# EAGLE board Comim_OBC-v.3.0 (EAGLE 9.4.2)
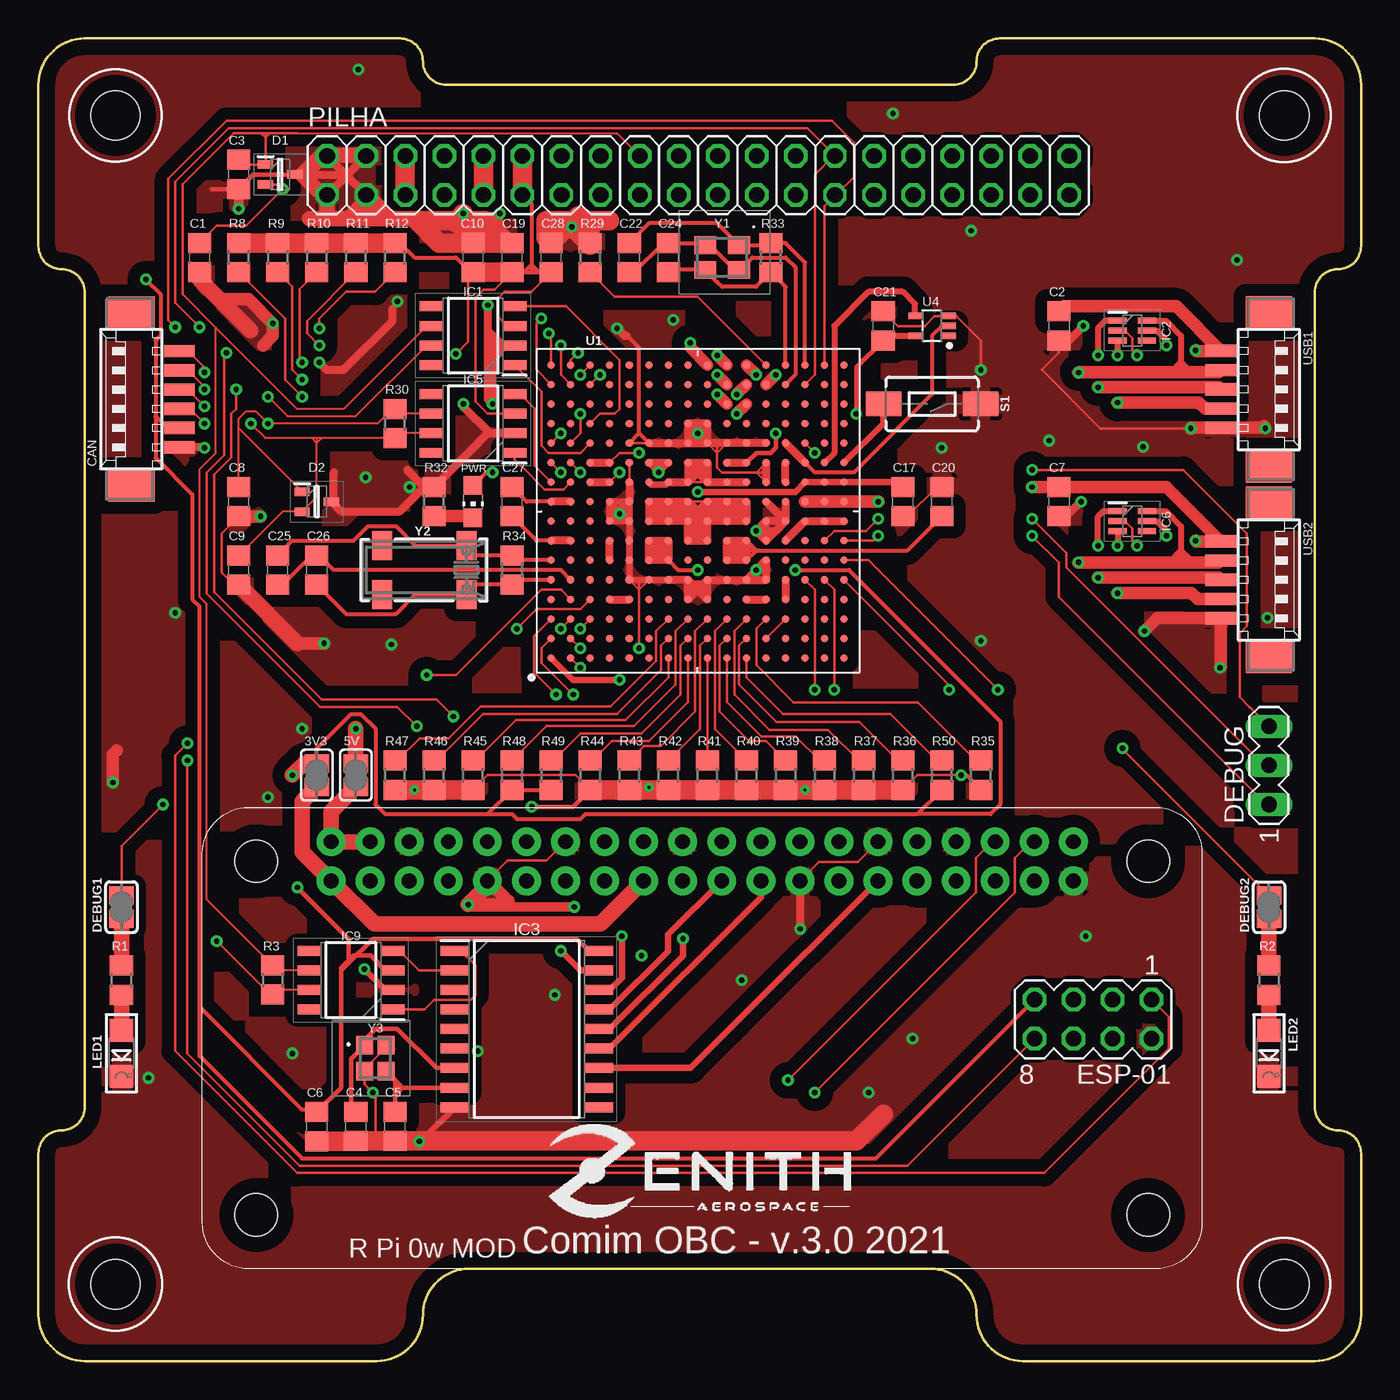
[diagram p5: board, top side]
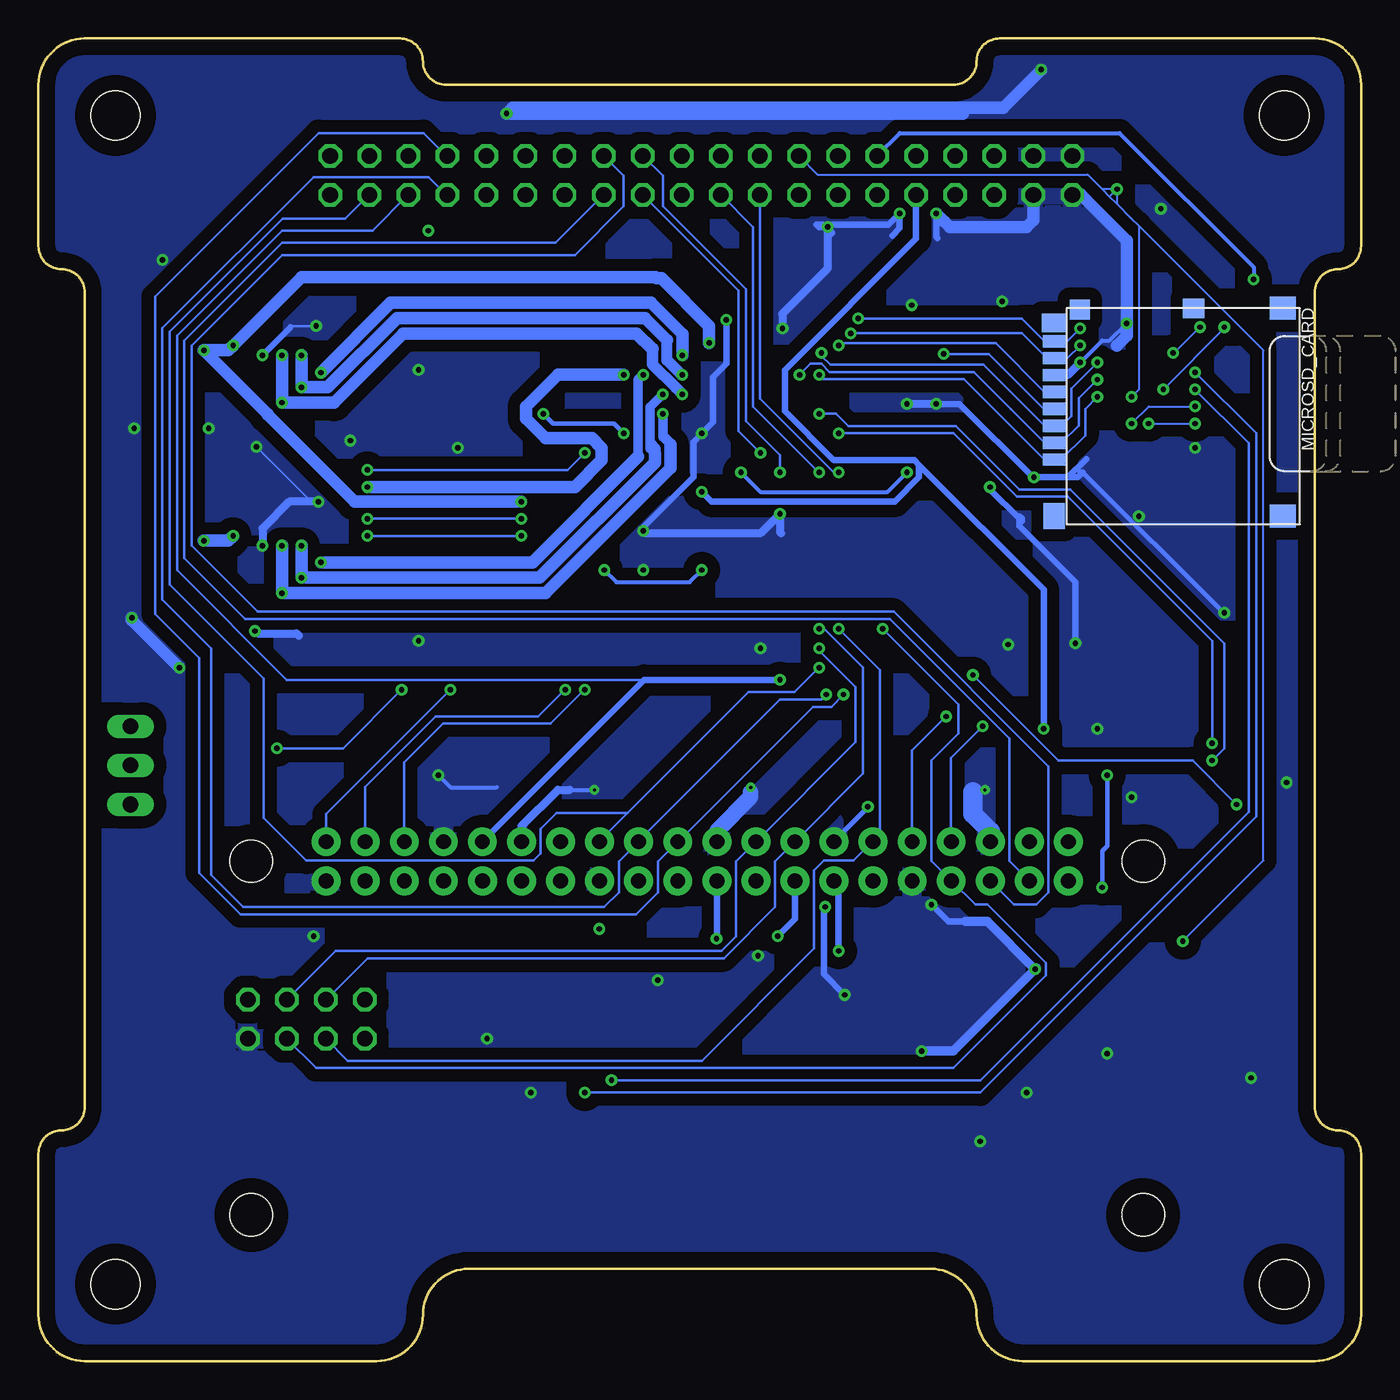
[diagram p6: board, bottom side, seen from below]

Size 86 x 86 mm. Coordinates in mm from the lower left corner, seen from the top.
Outline: 0,83 0,72.5 arc90 1.5,71 arc-90 3,69.5 3,16.5 arc-90 1.5,15 arc90 0,13.5 0,3 arc90 3,0 22,0 arc90 25,3 arc-90 28,6 58,6 arc-90 61,3 arc90 64,0 83,0 arc90 86,3 86,13.5 arc90 84.5,15 arc-90 83,16.5 83,69.5 arc-90 84.5,71 arc90 86,72.5 86,83 arc90 83,86 62.5,86 arc90 61,84.5 arc-90 59.5,83 26.5,83 arc-90 25,84.5 arc90 23.5,86 3,86 arc90 0,83
Copper layers (1*16): Top 0.035mm / dielectric 1.5mm / Bottom 0.035mm
Design rules "default *": minimum track width 6mil, minimum drill 0.35mm, track to track 6mil, track to pad 6mil, pad to pad 6mil, via to via 6mil, smd to smd 6mil, copper to edge 40mil, drill to drill 6mil, minimum pad ring 10mil, minimum via ring 8mil, stop-mask expansion 4mil, vias tented up to drill 30mil, thermal gap 10mil
Holes 3.2 mm at 5,5 81,5 81,81 5,81

## Footprints (pad centres in the part's own frame; a part is rotated, then mirrored left to right if it is on the bottom)
SJ = smd 1.168 x 1.6: 1 -0.762,0; 2 0.762,0
C0805 = smd 1.3 x 1.5: 1 -0.95,0; 2 0.95,0
53261-06 = smd 0.8 x 2: 1 3.125,-2.5; 2 1.875,-2.5; 3 0.625,-2.5; 4 -0.625,-2.5; 5 -1.875,-2.5; 6 -3.125,-2.5 | smd 2.1 x 3: S1 5.625,0.625; S2 -5.625,0.625
SOT65P210X110-3N = smd 1 x 0.55: 1 -0.95,0.65; 2 -0.95,-0.65; 3 0.95,0
MA03-1 = drill 1.016 long: 1 -2.54,0; 2 0,0; 3 2.54,0
SOLDERJUMPER_REFLOW_NOPASTE = smd 1.168 x 1.6: 1 -0.762,0; 2 0.762,0
MA04-2 = drill 1.016 octagon: 1 -3.81,-1.27; 2 -3.81,1.27; 3 -1.27,-1.27; 4 -1.27,1.27; 5 1.27,-1.27; 6 1.27,1.27; 7 3.81,-1.27; 8 3.81,1.27
SOIC127P600X175-8N = smd 1.528 x 0.65: 1 -2.711,1.905; 2 -2.711,0.635; 3 -2.711,-0.635; 4 -2.711,-1.905; 5 2.711,-1.905; 6 2.711,-0.635; 7 2.711,0.635; 8 2.711,1.905
SOT65P210X110-6N = smd 1.2 x 0.4: 1 -0.95,0.65; 2 -0.95,0; 3 -0.95,-0.65; 4 0.95,-0.65; 5 0.95,0; 6 0.95,0.65
SOIC127P1030X265-18N = smd 1.85 x 0.65: 1 -4.675,5.08; 2 -4.675,3.81; 3 -4.675,2.54; 4 -4.675,1.27; 5 -4.675,0; 6 -4.675,-1.27; 7 -4.675,-2.54; 8 -4.675,-3.81; 9 -4.675,-5.08; 10 4.675,-5.08; 11 4.675,-3.81; 12 4.675,-2.54; 13 4.675,-1.27; 14 4.675,0; 15 4.675,1.27; 16 4.675,2.54; 17 4.675,3.81; 18 4.675,5.08
CHIPLED_1206 = smd 1.5 x 1.5: A 0,-1.496; C 0,1.496
MOLEX-502774-0891-MICROSD = smd 0.8 x 1.5: 1 -3.3,8.2; 2 -2.2,8.2; 3 -1.1,8.2; 4 0,8.2; 5 1.1,8.2; 6 2.2,8.2; 7 3.3,8.2; 8 4.4,8.2 | smd 1.29 x 1.3: 9 6.455,6.55 | smd 1.29 x 1.4: 10 6.54,-0.85 | smd 1.5 x 1.7: 11 6.54,-6.65; 12 -6.96,-6.65 | smd 1.7 x 1.4: 14 -6.96,8.2 | smd 1.2 x 1.6: 15 5.6,8.2
2X20 = drill 1.016 octagon: 1 -24.13,-1.27; 2 -24.13,1.27; 3 -21.59,-1.27; 4 -21.59,1.27; 5 -19.05,-1.27; 6 -19.05,1.27; 7 -16.51,-1.27; 8 -16.51,1.27; 9 -13.97,-1.27; 10 -13.97,1.27; 11 -11.43,-1.27; 12 -11.43,1.27; 13 -8.89,-1.27; 14 -8.89,1.27; 15 -6.35,-1.27; 16 -6.35,1.27; 17 -3.81,-1.27; 18 -3.81,1.27; 19 -1.27,-1.27; 20 -1.27,1.27; 21 1.27,-1.27; 22 1.27,1.27; 23 3.81,-1.27; 24 3.81,1.27; 25 6.35,-1.27; 26 6.35,1.27; 27 8.89,-1.27; 28 8.89,1.27; 29 11.43,-1.27; 30 11.43,1.27; 31 13.97,-1.27; 32 13.97,1.27; 33 16.51,-1.27; 34 16.51,1.27; 35 19.05,-1.27; 36 19.05,1.27; 37 21.59,-1.27; 38 21.59,1.27; 39 24.13,-1.27; 40 24.13,1.27
CHIP-LED0805 = smd 1.2 x 1.2: A 0,-1.05; C 0,1.05
R0805 = smd 1.3 x 1.5: 1 -0.95,0; 2 0.95,0
TACTILE_SWITCH_SMD_6.0X3.5MM = smd 2.3 x 1.6: 1 -3.15,0; 2 3.15,0
OSD335X-BGA-256 = smd 0.5 x 0.5: A1 -9.525,-9.525; A2 -9.525,-8.255; A3 -9.525,-6.985; A4 -9.525,-5.715; A5 -9.525,-4.445; A6 -9.525,-3.175; A7 -9.525,-1.905; A8 -9.525,-0.635; A9 -9.525,0.635; A10 -9.525,1.905; A11 -9.525,3.175; A12 -9.525,4.445; A13 -9.525,5.715; A14 -9.525,6.985; A15 -9.525,8.255; A16 -9.525,9.525; B1 -8.255,-9.525; B2 -8.255,-8.255; B3 -8.255,-6.985; B4 -8.255,-5.715; B5 -8.255,-4.445; B6 -8.255,-3.175; B7 -8.255,-1.905; B8 -8.255,-0.635; B9 -8.255,0.635; B10 -8.255,1.905; B11 -8.255,3.175; B12 -8.255,4.445; B13 -8.255,5.715; B14 -8.255,6.985; B15 -8.255,8.255; B16 -8.255,9.525; C1 -6.985,-9.525; C2 -6.985,-8.255; C3 -6.985,-6.985; C4 -6.985,-5.715; C5 -6.985,-4.445; C6 -6.985,-3.175; C7 -6.985,-1.905; C8 -6.985,-0.635; C9 -6.985,0.635; C10 -6.985,1.905; C11 -6.985,3.175; C12 -6.985,4.445; C13 -6.985,5.715; C14 -6.985,6.985; C15 -6.985,8.255; C16 -6.985,9.525; D1 -5.715,-9.525; D2 -5.715,-8.255; D3 -5.715,-6.985; D4 -5.715,-5.715; D5 -5.715,-4.445; D6 -5.715,-3.175; D7 -5.715,-1.905; D8 -5.715,-0.635; D9 -5.715,0.635; D10 -5.715,1.905; D11 -5.715,3.175; D12 -5.715,4.445; D13 -5.715,5.715; D14 -5.715,6.985; D15 -5.715,8.255; D16 -5.715,9.525; E1 -4.445,-9.525; E2 -4.445,-8.255; E3 -4.445,-6.985; E4 -4.445,-5.715; E5 -4.445,-4.445; E6 -4.445,-3.175; E7 -4.445,-1.905; E8 -4.445,-0.635; E9 -4.445,0.635; E10 -4.445,1.905; E11 -4.445,3.175; E12 -4.445,4.445; E13 -4.445,5.715; E14 -4.445,6.985; E15 -4.445,8.255; E16 -4.445,9.525; F1 -3.175,-9.525; F2 -3.175,-8.255; F3 -3.175,-6.985; F4 -3.175,-5.715; F5 -3.175,-4.445; F6 -3.175,-3.175; F7 -3.175,-1.905; F8 -3.175,-0.635; F9 -3.175,0.635; F10 -3.175,1.905; F11 -3.175,3.175; F12 -3.175,4.445; F13 -3.175,5.715; F14 -3.175,6.985; F15 -3.175,8.255; F16 -3.175,9.525; G1 -1.905,-9.525; G2 -1.905,-8.255; G3 -1.905,-6.985; G4 -1.905,-5.715; G5 -1.905,-4.445; G6 -1.905,-3.175; G7 -1.905,-1.905; G8 -1.905,-0.635; G9 -1.905,0.635; G10 -1.905,1.905; G11 -1.905,3.175; G12 -1.905,4.445; G13 -1.905,5.715; G14 -1.905,6.985; G15 -1.905,8.255; G16 -1.905,9.525; H1 -0.635,-9.525; H2 -0.635,-8.255; H3 -0.635,-6.985; H4 -0.635,-5.715; H5 -0.635,-4.445; H6 -0.635,-3.175; H7 -0.635,-1.905; H8 -0.635,-0.635; H9 -0.635,0.635; H10 -0.635,1.905; H11 -0.635,3.175; H12 -0.635,4.445; H13 -0.635,5.715; H14 -0.635,6.985; H15 -0.635,8.255; H16 -0.635,9.525; J1 0.635,-9.525; J2 0.635,-8.255; J3 0.635,-6.985; J4 0.635,-5.715; J5 0.635,-4.445; J6 0.635,-3.175; J7 0.635,-1.905; J8 0.635,-0.635; J9 0.635,0.635; J10 0.635,1.905; J11 0.635,3.175; J12 0.635,4.445; J13 0.635,5.715; J14 0.635,6.985; J15 0.635,8.255; J16 0.635,9.525; K1 1.905,-9.525; K2 1.905,-8.255; K3 1.905,-6.985; K4 1.905,-5.715; K5 1.905,-4.445; K6 1.905,-3.175; K7 1.905,-1.905; K8 1.905,-0.635; K9 1.905,0.635; K10 1.905,1.905; K11 1.905,3.175; K12 1.905,4.445; K13 1.905,5.715; K14 1.905,6.985; K15 1.905,8.255; K16 1.905,9.525; L1 3.175,-9.525; L2 3.175,-8.255; L3 3.175,-6.985; L4 3.175,-5.715; L5 3.175,-4.445; L6 3.175,-3.175; L7 3.175,-1.905; L8 3.175,-0.635; L9 3.175,0.635; L10 3.175,1.905; L11 3.175,3.175; L12 3.175,4.445; L13 3.175,5.715; L14 3.175,6.985; L15 3.175,8.255; L16 3.175,9.525; M1 4.445,-9.525; M2 4.445,-8.255; M3 4.445,-6.985; M4 4.445,-5.715; M5 4.445,-4.445; M6 4.445,-3.175; M7 4.445,-1.905; M8 4.445,-0.635; M9 4.445,0.635; M10 4.445,1.905; M11 4.445,3.175; M12 4.445,4.445; M13 4.445,5.715; M14 4.445,6.985; M15 4.445,8.255; M16 4.445,9.525; N1 5.715,-9.525; N2 5.715,-8.255; N3 5.715,-6.985; N4 5.715,-5.715; N5 5.715,-4.445; N6 5.715,-3.175; N7 5.715,-1.905; N8 5.715,-0.635; N9 5.715,0.635; N10 5.715,1.905; N11 5.715,3.175; N12 5.715,4.445; N13 5.715,5.715; N14 5.715,6.985; N15 5.715,8.255; N16 5.715,9.525; P1 6.985,-9.525; P2 6.985,-8.255; P3 6.985,-6.985; P4 6.985,-5.715; P5 6.985,-4.445; P6 6.985,-3.175; P7 6.985,-1.905; P8 6.985,-0.635; P9 6.985,0.635; P10 6.985,1.905; P11 6.985,3.175; P12 6.985,4.445; P13 6.985,5.715; P14 6.985,6.985; P15 6.985,8.255; P16 6.985,9.525; R1 8.255,-9.525; R2 8.255,-8.255; R3 8.255,-6.985; R4 8.255,-5.715; R5 8.255,-4.445; R6 8.255,-3.175; R7 8.255,-1.905; R8 8.255,-0.635; R9 8.255,0.635; R10 8.255,1.905; R11 8.255,3.175; R12 8.255,4.445; R13 8.255,5.715; R14 8.255,6.985; R15 8.255,8.255; R16 8.255,9.525; T1 9.525,-9.525; T2 9.525,-8.255; T3 9.525,-6.985; T4 9.525,-5.715; T5 9.525,-4.445; T6 9.525,-3.175; T7 9.525,-1.905; T8 9.525,-0.635; T9 9.525,0.635; T10 9.525,1.905; T11 9.525,3.175; T12 9.525,4.445; T13 9.525,5.715; T14 9.525,6.985; T15 9.525,8.255; T16 9.525,9.525
RASPBERRY-PI-ZERO = drill 0.97 pad 1.88: 1 -23.97,23.23; 2 -23.97,25.77; 3 -21.43,23.23; 4 -21.43,25.77; 5 -18.89,23.23; 6 -18.89,25.77; 7 -16.35,23.23; 8 -16.35,25.77; 9 -13.81,23.23; 10 -13.81,25.77; 11 -11.27,23.23; 12 -11.27,25.77; 13 -8.73,23.23; 14 -8.73,25.77; 15 -6.19,23.23; 16 -6.19,25.77; 17 -3.65,23.23; 18 -3.65,25.77; 19 -1.11,23.23; 20 -1.11,25.77; 21 1.43,23.23; 22 1.43,25.77; 23 3.97,23.23; 24 3.97,25.77; 25 6.51,23.23; 26 6.51,25.77; 27 9.05,23.23; 28 9.05,25.77; 29 11.59,23.23; 30 11.59,25.77; 31 14.13,23.23; 32 14.14,25.77; 33 16.67,23.23; 34 16.67,25.77; 35 19.21,23.23; 36 19.21,25.77; 37 21.75,23.23; 38 21.75,25.77; 39 24.29,23.23; 40 24.29,25.77 | hole 2.75: -28.84,24.5; 29.16,24.5; -28.84,1.5; 29.16,1.5
SC70(TI-DCK) = smd 0.4 x 0.9: 1 0.65,1.1; 2 0,1.1; 3 -0.65,1.1; 4 -0.65,-1.1; 5 0.65,-1.1
53261-05 = smd 0.8 x 2: 1 2.5,-2.5; 2 1.25,-2.5; 3 0,-2.5; 4 -1.25,-2.5; 5 -2.5,-2.5 | smd 2.1 x 3: S1 5,0.625; S2 -5,0.625
TSX3225240000MF15VC0 = smd 1.4 x 1.15: 1 -1.1,-0.8; 2 1.1,-0.8; 3 1.1,0.8; 4 -1.1,0.8
CRYSTAL_8X3.8 = smd 1.3 x 1.9: P$1 -2.75,-1.6; P$2 2.75,-1.6; P$3 2.75,1.6; P$4 -2.75,1.6
FA20H160000MF12ZAC3 = smd 1.2 x 1.1: 1 -0.85,-0.7; 2 0.85,-0.7; 3 0.85,0.7; 4 -0.85,0.7

## Placement (x,y rotation side)
3V3  [SJ]  18.1,38.1 270 top
5V  [SJ]  20.64,38.1 90 top
C1  33p  [C0805]  10.48,71.75 270 top
C2  100n  [C0805]  66.36,67.31 270 top
C3  33p  [C0805]  13.02,77.15 270 top
C4  18p  [C0805]  20.64,15.25 270 top
C5  18p  [C0805]  23.18,15.25 270 top
C6  100nF  [C0805]  18.1,15.24 270 top
C7  100n  [C0805]  66.36,55.88 270 top
C8  33p  [C0805]  13.02,55.88 270 top
C9  33p  [C0805]  13.02,51.44 270 top
C10  100n  [C0805]  28.26,71.75 90 top
C17  22u  [C0805]  56.2,55.88 270 top
C19  1n  [C0805]  30.8,71.75 90 top
C20  22u  [C0805]  58.74,55.88 90 top
C21  100n  [C0805]  54.93,67.31 90 top
C22  18p  [C0805]  38.42,71.75 270 top
C24  18p  [C0805]  40.96,71.75 90 top
C25  18p  [C0805]  15.56,51.44 270 top
C26  18p  [C0805]  18.1,51.44 90 top
C27  100n  [C0805]  30.8,55.88 90 top
C28  1n  [C0805]  33.34,71.75 90 top
CAN  53261-06  [53261-06]  6.67,62.55 90 top
D1  PESD2CANFD27L-UX  [SOT65P210X110-3N]  15.72,77.15 0 top
D2  PESD2CANFD27L-UX  [SOT65P210X110-3N]  18.1,55.88 0 top
DEBUG  [MA03-1]  80.01,38.73 90 top
DEBUG1  [SOLDERJUMPER_REFLOW_NOPASTE]  5.4,29.51 270 top
DEBUG2  [SOLDERJUMPER_REFLOW_NOPASTE]  80.01,29.51 270 top
ESP-01  [MA04-2]  68.58,22.23 180 top
IC1  TCAN330DR  [SOIC127P600X175-8N]  28.26,66.67 180 top
IC2  TPD4S009DCKRG4  [SOT65P210X110-6N]  71.12,66.99 0 top
IC3  MCP2510T-I_SO  [SOIC127P1030X265-18N]  31.75,21.59 0 top
IC5  TCAN330DR  [SOIC127P600X175-8N]  28.26,60.96 180 top
IC6  TPD4S009DCKRG4  [SOT65P210X110-6N]  71.12,54.61 0 top
IC9  TCAN330DR  [SOIC127P600X175-8N]  20.32,24.78 180 top
LED1  [CHIPLED_1206]  5.4,20.02 180 top
LED2  [CHIPLED_1206]  80.01,20.02 180 top
MICROSD_CARD  MOLEX-502774-0891-MICROSD  [MOLEX-502774-0891-MICROSD]  11.75,61.91 90 bottom
PILHA  [2X20]  42.9,77.1 0 top
PWR  [CHIP-LED0805]  28.26,55.88 180 top
R1  100M  [R0805]  5.4,24.77 90 top
R2  100M  [R0805]  80.01,24.77 90 top
R3  120  [R0805]  15.24,24.78 90 top
R8  4,7k  [R0805]  13.02,71.75 90 top
R9  4,7k  [R0805]  15.56,71.75 90 top
R10  4,7k  [R0805]  18.1,71.75 90 top
R11  4,7k  [R0805]  20.64,71.75 90 top
R12  4,7k  [R0805]  23.18,71.75 90 top
R29  10k  [R0805]  35.88,71.75 270 top
R30  120  [R0805]  23.18,60.96 90 top
R32  1k  [R0805]  25.72,55.88 270 top
R33  1M  [R0805]  47.62,71.75 90 top
R34  1M  [R0805]  30.8,51.44 90 top
R35  100k  [R0805]  61.28,38.1 90 top
R36  100k  [R0805]  56.2,38.1 90 top
R37  100k  [R0805]  53.66,38.1 90 top
R38  100k  [R0805]  51.12,38.1 90 top
R39  100k  [R0805]  48.58,38.1 90 top
R40  100k  [R0805]  46.04,38.1 90 top
R41  100k  [R0805]  43.5,38.1 90 top
R42  100k  [R0805]  40.96,38.1 90 top
R43  100k  [R0805]  38.42,38.1 90 top
R44  100k  [R0805]  35.88,38.1 90 top
R45  100k  [R0805]  28.26,38.1 90 top
R46  100k  [R0805]  25.72,38.1 90 top
R47  100k  [R0805]  23.18,38.1 90 top
R48  100k  [R0805]  30.8,38.1 270 top
R49  100k  [R0805]  33.34,38.1 270 top
R50  100k  [R0805]  58.74,38.1 270 top
S1  MOMENTARY-SWITCH-SPST-SMD-6.0X3.5MM  [TACTILE_SWITCH_SMD_6.0X3.5MM]  58.1,62.23 180 top
U1  OSD3358-512M-BSM  [OSD335X-BGA-256]  42.86,55.24 0 top
U2  RASPBERRY-PI+PIZERO  [RASPBERRY-PI-ZERO]  43,8 0 top
U4  SN74LVC1G07DCK  [SC70(TI-DCK)]  58.1,67.31 270 top
USB1  53261-05  [53261-05]  79.38,63.18 270 top
USB2  53261-05  [53261-05]  79.38,50.8 270 top
Y1  TSX-3225_24.0000MF15V-C0  [TSX3225240000MF15VC0]  44.45,71.75 180 top
Y2  32kHz  [CRYSTAL_8X3.8]  25.08,51.44 180 top
Y3  FA-20H_16.0000MF10Z-AJ0  [FA20H160000MF12ZAC3]  21.91,19.7 270 top

## Tracks (layer width: path | path; a pad name or v marks a point on that pad's centre or on a via)
3V3  (via drill 0.35)
  Top 0.152: C28.1 32.06,69.53 30.32,69.53 29.84,69.06 29.84,67.94 30.48,67.31 IC1.3 | IC5.3 29.21,61.59 28.42,62.39 28.42,69.14 28.93,69.65 29.64,69.65 C19.1 31.75,70.81 | v27.15,65.48 27.94,66.28 27.94,70.49 C10.1
  Top 0.254: R49.2 R48.2 29.21,35.56 | 32.07,70.81 31.75,70.81 31.59,70.81 32.06,71.28 32.07,71.28 | 32.07,70.81 32.54,70.81 | 32.54,70.81 C28.1 | PILHA.11 32.07,75.23 32.07,71.28 | 32.07,71.28 32.07,70.81 | 32.54,70.81 32.07,71.28 | 15.24,72.7 15.4,72.7 R9.2 R10.2 | 20.8,72.7 R11.2 | R12.2 23.5,72.7 24.45,71.75 27.15,71.75 27.98,70.92 30.36,70.92 | CAN.5 8.38,60.67 7.62,61.44 | 7.62,61.44 7.62,66.36 7.94,66.67 7.94,69.37 v6.99,70.33 | 7.62,61.44 7.62,58.74 10,56.36 10,49.53 10.48,49.05 10.48,23.02 | 10.48,23.02 17.14,16.35 17.46,16.35 17.94,16.35 | 3V3.1 18.1,39.85 20.32,42.07 20.95,42.07 21.91,41.12 21.91,36.2 22.54,35.56 29.21,35.56 | 29.21,35.56 30.8,35.56 31.11,35.24 35.24,35.24 35.56,35.56 57.15,35.56 | 57.15,35.56 R50.2 | U1.G6 41.59,51.44 v42.86,51.44 | 57.15,35.56 61.91,35.56 62.55,36.2 62.55,41.59 52.7,51.44 v49.21,51.44 | ESP-01.7 54.45,13.18 17.14,13.18 10.48,19.84 10.48,23.02
  Top 0.305: 19.68,25.4 19.68,17.78 C6.1 | 19.68,25.4 19.68,25.56 20.49,26.36 21.6,26.36 22.55,25.41 IC9.3 | 19.68,25.4 20.16,25.88 | 20.16,25.88 21.75,27.46 35,27.46 35.79,26.67 IC3.18 | 20.16,25.88 20.16,27.46 v16.83,30.8
  Top 0.406: C6.1 17.62,16.19 17.46,16.35 | C19.1 30.48,70.81 30.36,70.92
  Top 0.508: U1.F7 U1.G7 | U1.G7 U1.G6 | U1.G6 U1.F6 | U1.F6 U1.F7 | U1.F7 U1.G6 | U1.G7 U1.F6
  Top 1.016: v16.51,38.1 17.27,38.86 3V3.1
  Top 1.27: PILHA.12 PILHA.11 | R12.2 20.8,72.7 | R11.2 R10.2 15.4,72.7 | R8.2 15.24,72.7 | C10.1 C19.1
  Bottom 0.152: MICROSD_CARD.4 20.64,61.91 24.21,65.48 v27.15,65.48
  Bottom 0.254: v49.21,51.44 48.42,50.64 43.66,50.64 v42.86,51.44 | v6.99,70.33 6.99,71.12 15.72,79.85 29.99,79.85 PILHA.12
  Bottom 0.305: v16.83,30.8 16.83,33.18 16.51,33.5 v16.51,38.1
5V  (via drill 0.35)
  Top 0.406: v42.86,56.52 49.21,56.52 U1.P10 U1.R10 U1.T10 55.88,57.15 C17.1
  Top 1.016: 5V.2 v20.64,41.12
  Top 1.27: PILHA.10 PILHA.9
  Bottom 0.254: 34.29,58.58 34.37,58.66
  Bottom 0.406: v42.86,56.52 42.23,55.88 30.32,55.88 28.73,57.47 28.73,58.26 | 28.73,58.26 29.05,58.58 34.29,58.58 | PILHA.9 28.93,72.97 37.47,64.44 37.47,61.75 34.37,58.66 | v20.64,41.12 20.64,50.16 28.73,58.26
!CHRG  (via drill 0.35)
  Top 0.152: v33.66,43.34 32.23,44.77 32.23,47.15 U1.A3
  Bottom 0.152: PILHA.34 59.48,78.37 60.96,79.85 67.79,79.85 78.42,69.22 78.42,48.58 75.56,45.72 75.56,31.75 72.87,29.05 47.15,29.05 45.72,30.48 45.72,32.48 U2.22 35.66,42.55 34.45,42.55 v33.66,43.34
!CS_CAN  (via drill 0.35)
  Top 0.406: IC3.16 37.15,24.13 37.94,24.92 v37.94,27.62
  Bottom 0.406: v37.94,27.62 36.81,28.75 U2.15
!FAULT  (via drill 0.35)
  Top 0.152: U1.B1 v35.24,45.09
  Bottom 0.152: PILHA.37 64.5,75.83 66.05,74.28 70.14,74.28 77.47,66.95 77.47,50.48 71.36,44.37 71.36,35.32 68.58,32.54 53.82,32.54 53.34,33.02 53.34,34.61 52.31,35.64 47.7,35.64 | v35.24,45.09 36.83,43.5 39.85,43.5 47.7,35.64 | 47.7,35.64 49.51,33.83 U2.26
!INT_CAN
  Top 0.406: U2.29 45.34,21.98 44.91,21.55 42.41,19.05 IC3.12
!RESET_CAN  (via drill 0.35)
  Top 0.406: IC3.17 35.24,25.4 v33.97,26.67
  Bottom 0.406: v33.97,26.67 33.97,30.93 U2.13
ALRT1  (via drill 0.35)
  Top 0.152: U1.A2 32.7,46.35 32.7,45.4 v34.77,43.34
  Bottom 0.152: PILHA.33 59.48,75.83 60.64,76.99 68.1,76.99 77.95,67.15 77.95,49.53 74.76,46.34 74.76,31.61 72.68,29.53 49.21,29.53 48.26,30.48 48.26,32.48 U2.24 46.97,33.83 37.78,43.02 35.08,43.02 v34.77,43.34
BAT+
  Top 1.27: PILHA.6 PILHA.5
CAN0_H  (via drill 0.35)
  Top 0.127: v13.81,60.96 14.76,60.01 17.78,60.01 | CAN.4 9.83,61.92 | IC5.7 23.49,60.33 | R30.1 18.41,60.01 | 18.41,60.01 18.1,60.01 | 18.1,60.01 17.78,60.01 | 18.1,59.69 18.1,56.18 D2.2 15.86,55.23 C9.1 | 18.1,60.01 18.1,59.69 | 18.1,59.69 18.41,60.01 | 18.1,59.69 17.78,60.01
  Top 0.152: v13.81,60.96 | 9.83,61.92 v10.79,60.96 | 23.49,60.33 R30.1
  Bottom 0.127: v13.81,60.96 v10.79,60.96
CAN0_L  (via drill 0.35)
  Top 0.127: 23.02,61.91 22.9,61.79 22.07,60.96 v14.92,60.96 14.13,61.75 13.49,61.75 13.02,61.28 13.02,60.66 | CAN.3 9.69,63.17 | IC5.6 23.49,61.59 | D2.1 13.02,60.66 | C8.1 13.02,60.66
  Top 0.152: 9.69,63.17 v10.79,62.07 | 23.49,61.59 R30.2
  Top 0.406: R30.2 23.06,61.79 22.9,61.79
  Bottom 0.127: v14.92,60.96 13.81,62.07 v10.79,62.07
CAN0RX
  Top 0.152: U1.A10 32.26,58.23 32.26,61.92 31.31,62.87 IC5.4
CAN0TX
  Top 0.152: U1.B10 34.13,56.67 32.92,56.67 31.38,58.21 31.33,58.26 30.97,58.63 IC5.1
CAN1RX
  Top 0.152: U1.C13 36.51,61.59 37.47,61.59 37.78,61.91 37.78,65.09 34.29,68.58 IC1.4
CAN1TX
  Top 0.152: U1.C12 35.24,59.05 33.18,59.05 32.7,59.53 32.7,63.04 IC1.1
CAN_H  (via drill 0.35)
  Top 0.127: 15.07,23.83 v11.59,27.3 | v14.92,62.71 16.19,61.44 20.64,61.44 25.24,66.04 | IC9.7 15.55,24.14
  Top 0.152: R3.1 15.07,23.83 | 25.24,66.04 IC1.7 | D1.2 15.57,76.5 v15.88,76.2 13.49,73.82 11.59,73.82 C1.1
  Top 0.584: 15.55,24.14 R3.1
  Bottom 0.127: PILHA.16 35.33,77.15 17.78,77.15 16.83,76.2 | 14.45,73.82 6.35,65.72 6.35,32.54 v11.59,27.3 | 15.88,75.25 14.92,74.3 14.45,73.82 | 15.88,75.25 16.35,75.72 | 16.35,75.72 16.83,76.2 | 14.45,73.82 14.45,63.18 v14.92,62.71 | v15.88,76.2 16.35,75.72 | v15.88,76.2 16.83,76.2 | v15.88,76.2 15.88,75.25
CAN_L
  Top 0.127: R3.2 10.95,30.01 10.95,49.21 10.48,49.69 10.48,58 11.53,59.05 11.53,67.21 16.83,61.91 19.84,61.91 25.24,67.31 | PILHA.18 37.61,79.85 16.83,79.85 | IC9.6 15.55,25.41
  Top 0.152: 25.24,67.31 IC1.6 | 15.55,25.41 15.32,25.64 | D1.1 | 16.83,79.85 15.08,79.85 | 15.08,79.85 14.76,79.85 | 14.76,79.85 14.45,79.85 | 14.45,79.85 12.7,79.85 9.37,76.52 9.37,69.37 11.53,67.21 | D1.1 14.76,79.53 | 14.76,79.53 14.76,79.85 | 14.76,79.53 14.45,79.85 | 14.76,79.53 15.08,79.85 | D1.1 13.32,77.8 C3.1
  Top 0.584: 15.32,25.64 R3.2
CH_PD  (via drill 0.35)
  Top 0.152: U1.B2 v35.24,46.35
  Bottom 0.152: ESP-01.3 66.67,26.67 41.59,26.67 40.64,27.62 40.64,32.48 U2.18 32.86,40.26 32.86,43.81 35.24,46.2 v35.24,46.35
D+0  (via drill 0.35)
  Top 0.4: IC2.1 69.36,67.64 68.9,67.18 v68.9,65.41
  Top 0.734: U1.K15 v44.13,64.14
  Top 0.8: USB1.3 76.74,63.31 v68.9,63.31 v68.9,63.32
  Bottom 0.7: v44.13,64.14 44.2,64.14 45.13,65.07 45.13,66.38
  Bottom 0.8: 45.13,66.38 46.58,67.81 62.69,67.81 67.18,63.32 v68.9,63.32 v68.9,65.41
D+1  (via drill 0.35)
  Top 0.152: IC6.1
  Top 0.4: v68.9,53.02 68.9,54.93 69.23,55.26 IC6.1
  Top 0.734: U1.L15 v45.4,62.87
  Top 0.8: 76.72,50.94 76.86,50.8 USB2.3 76.74,50.94 75.78,50.94 | 75.78,50.94 | 75.78,50.94 v68.9,50.94
  Bottom 0.406: 46.24,59.34 46.24,59.9
  Bottom 0.61: v45.4,62.87 46.24,62.03 46.24,59.9 | 46.24,59.34 45.92,59.02 45.83,58.93 45.83,59.33 46.24,59.74 46.24,59.34
  Bottom 0.8: 45.92,59.02 45.92,58.44 53.42,50.94 v68.9,50.94 v68.9,53.02
D-0  (via drill 0.35)
  Top 0.254: USB1.4 76.86,64.45
  Top 0.4: IC2.6 73.33,67.64 74.3,66.67 74.3,64.94 | 74.3,64.31 74.3,64.94 | 74.3,64.94 73.66,64.31 | 74.3,64.94 74.93,64.31
  Top 0.734: U1.K16 v44.13,65.41
  Top 0.8: USB1.4 76.75,64.31 74.93,64.31 74.3,64.31 73.66,64.31 67.66,64.31 v67.63,64.27
  Bottom 0.8: v67.63,64.27 63.09,68.81 46.17,68.81 44.13,66.77 v44.13,65.41
D-1  (via drill 0.35)
  Top 0.152: USB2.4 76.86,52.07
  Top 0.4: IC6.6 73.33,55.26 74.3,54.29 74.3,52.7 | 74.3,51.93 74.3,52.7 | 74.3,52.7 73.52,51.93 73.5,51.93 | 74.3,52.7 74.93,52.07 74.93,51.93
  Top 0.734: v46.67,64.14 U1.L16
  Top 0.8: USB2.4 76.84,52.05 76.72,51.93 74.93,51.93 74.3,51.93 73.5,51.93 v67.63,51.93 v67.63,51.94
  Bottom 0.61: v46.67,64.14 47,63.81 47,58.8
  Bottom 0.8: v67.63,51.94 53.87,51.94 47,58.8
EEPROM_WP
  Top 0.152: U1.M2 U1.N3
GND  (via drill 0.2 pad 0.4, 0.35)
  Top 0.152: U1.E11 U1.E10 | U1.E12 U1.F12 | Y3.4 22.61,20.39 21.21,18.98 Y3.2 21.21,18 v21.75,17.46 21.91,17.3 21.91,14.29 | IC2.2 70.64,66.99 71.12,66.52 71.12,65.72 v71.44,65.41 | v74.93,60.64 69.06,60.64 65.25,64.45 66.36,65.56 C2.2 | IC6.2 70.64,54.61 71.12,54.13 71.12,53.34 v71.44,53.02 | C21.2 55.88,67.31 57.63,67.31 58.26,67.94 59.19,67.94 U4.3 59.67,67.96 61.28,66.36 v61.28,64.45 | R45.1 29.21,38.1 34.93,38.1 R44.1 | R36.1 57.15,38.1 v60.01,38.1 | C17.2 56.52,54.93 58.41,56.83 C20.2 | 29.22,31.26 U2.9 29.19,30.94 v27.94,29.69 | 29.22,31.26 30.5,32.54 33.04,32.54 U2.14 | 29.29,31.19 29.29,30.88 27.94,29.53 | 30.56,29.92 29.29,31.19 | 29.29,31.19 29.22,31.26 | 10.74,59.42 v10.79,59.37 10.85,59.42 11,59.42 | 25.24,36.99 25.56,36.99 R46.1 v24.45,37.15 | U2.25 50.74,32.46 53.28,32.46 U2.30 | 44.21,59.69 44.13,59.61 44.13,59.05 | 47.31,57.78 46.67,57.78 | 46.67,57.78 44.45,57.78 44.13,58.1 44.13,59.05 | U1.K12 44.13,59.05 | U1.J12 44.13,59.05 | U1.M11 46.67,57.78 | U1.M10 46.67,57.78 | v39.05,46.35 39.05,50.16 | 39.05,50.16 39.05,50.72 39.13,50.8 | U1.E5 39.05,50.16 | U1.F5 39.05,50.16 | C8.2 11.91,53.82 11.91,51.28 12.7,50.48 C9.2 | 13.65,69.06 13.02,69.06 12.86,68.9
  Top 0.254: R38.1 | v60.01,38.1 60.33,38.1 R35.1 | U1.F12 39.05,60.33 | U1.E12 39.05,60.33 | 38.1,66.83 38.26,66.67 39.05,65.88 39.05,60.33 | R43.1 38.57,37.31 v39.69,37.31 | v27.62,74.61 v30,74.61
  Top 0.305: v32.07,36.04 34.76,36.04 R44.1 | D1.3 13.97,77.15 13.18,76.36 | C3.2 11.27,76.2
  Top 0.406: U1.M7 U1.M8 | U1.D9 37.62,55.4 37.62,55.09 U1.D8 | v37.78,55.09 37.78,55.24 U1.E9 | U1.E9 U1.E8 | U1.E8 U1.E7 U1.E6 U1.E5 39.13,50.8 U1.F5 U1.G5 | U1.D9 U1.D8 | U1.D9 37.94,55.88 | 37.94,55.88 U1.E9 | U1.D8 U1.E8 | U1.E8 37.94,55.09 37.94,55.88 | v30,74.61 30,73.5 C19.2 | IC9.2 22.53,24.14 v21.19,25.48 | IC3.9 24.92,14.36 24.92,14.3
  Top 0.508: U1.N8 U1.M8 v46.67,53.98 | U1.H5 U1.G5 | U1.H5 42.55,50.48 43.18,50.48 U1.J5 | U1.J5 U1.K5 U1.L5 | U1.L5 U1.M5 U1.M6 v46.67,51.44 U1.L5 | U1.H5 U1.H4 U1.J5 | U1.J5 U1.J4 U1.H5 | U1.N9 U1.N8 | U1.N8 U1.M9 | U1.M11 47.31,57.78 U1.M10 | U1.E10 U1.E9 | U1.F12 U1.G12 U1.H12 | v67.94,67.31 67,66.36 C2.2 | C7.2 66.84,54.93 v67.79,55.88 | v46.67,53.98 47.94,53.98 U1.N8 | v46.67,53.98 U1.M7 U1.N8 | 10.74,59.42 CAN.6 | v18.26,64.93 18.73,64.45 19.84,64.45 23.02,67.63 23.02,68.42 | 38.26,66.67 38.1,66.67 v37.62,67.15 | 29.53,65.25 v29.53,62.23 29.21,62.55 29.21,66.99 | IC1.2 30.32,66.04 29.53,65.25 | v27.62,62.23 27.62,62.07 29.37,60.33 IC5.2 29.21,60.33 28.1,59.21 R32.1 | U2.25 49.51,28.12 v49.53,28.1 | U1.H12 U1.J12 | U1.J12 U1.J13 | U1.J13 U1.H13 | U1.H13 U1.H12 | U1.H12 v42.86,60.33 U1.J13 | U1.H13 U1.J12 | U1.J12 44.21,59.69 U1.K12 U1.L12 U1.M12 | IC1.2 30.16,66.04 29.53,66.67 | v29.21,68.66 29.21,66.99 | 29.53,66.67 29.21,66.99 | 29.53,65.25 29.53,65.96 | 29.53,65.96 29.53,66.67 | IC1.2 29.61,66.04 29.53,65.96 | D1.3 17.55,77.15 PILHA.2 19.99,77.15 | D1.3 17.45,77.15 PILHA.1 20.09,77.15 | D1.3 20.09,77.15 | 20.09,77.15 PILHA.4 | D1.3 19.99,77.15 | 19.99,77.15 PILHA.3 | 16.82,77.15 18.09,78.42 18.82,78.42 | 16.82,77.15 18.09,75.88 18.77,75.88 | D1.3 16.82,77.15 | 19.21,57.78 19.21,56.04 D2.3 19.68,55.24 23.5,55.24 25.08,56.83 R32.1 | R32.1 25.09,56.83 23.97,57.94
  Top 0.61: v34.85,29.53 27.94,29.53 | v13.02,74.93 C3.2 13.18,76.36
  Top 0.8: v74.93,60.64 74.97,60.68 USB1.1 79.57,60.68 79.69,60.8 | v71.91,47.47 72.75,48.3 USB2.1 76.88,45.12 v76.83,45.09
  Top 0.813: v27.94,29.69 30.32,29.69 | 30.32,29.69 30.56,29.92 | 30.32,29.69 30.32,30.16 29.29,31.19 | v4.84,37.62 4.84,39.45 5.08,39.69 | 16.83,46.67 v18.57,46.67 | v14.45,54.93 C8.2 | 11.75,69.06 13.65,69.06 v15.24,67.47 15.24,66.67 14.61,66.04
  Top 1.016: 24.61,74.14 24.45,74.3 22.54,74.3 | 22.54,74.3 21.27,74.3 | 20.16,74.3 21.27,74.3 | PILHA.3 21.31,74.33 21.27,74.3 | PILHA.3 22.54,74.6 22.54,74.3 | PILHA.3 21.31,75.44 20.16,74.3 | 18.77,75.88 PILHA.1 18.77,74.33 18.73,74.3 | 18.73,74.3 20.16,74.3 | 18.73,74.3 17.62,74.3 | PILHA.2 18.82,78.42 21.27,78.42 | 37.62,55.09 v37.78,55.09 | v27.94,29.69 29.22,30.97 29.22,31.26 | C9.2 16.83,46.67 | C1.2 10.48,70.33 11.75,69.06 13.81,66.99
  Top 1.27: C6.2 20.62,14.29 C4.2 C5.2 24.92,14.3 53.2,14.3 54.93,16.03 | v27.62,74.61 27.62,74.14 29.05,74.14 29.37,73.82 | v27.62,74.61 27.07,74.06 26.99,74.14 24.61,74.14 26.04,72.7 C10.2 | 29.37,73.82 29.37,73.98 | 29.37,73.82 30.48,72.7 C19.2 C10.2 | 34.69,74.05 v34.69,73.74 35.88,72.55 R29.1 35.88,73.82 36.2,74.14 | 34.69,74.06 35.08,74.45 35.4,74.14 36.2,74.14 | 34.69,74.06 34.69,74.05 | 34.69,74.05 C28.2 33.02,73.02 33.02,74.14 34.61,74.14 34.69,74.06 | 36.2,74.14 37.15,74.14 | R45.1 R46.1 R47.1 | R44.1 R43.1 R42.1 R41.1 R40.1 R39.1 R38.1 | R36.1 R37.1 R38.1 | C10.2 27.62,73.34 v27.62,74.61 | C10.2 29.37,73.82
  Bottom 0.152: v67.94,67.31 69.53,67.31 69.61,67.23 | v71.83,59.45 68.26,55.88 v67.79,55.88
  Bottom 0.254: 51.44,37.15 v49.85,37.15 | v60.01,38.1 59.21,37.31 56.2,37.31 | U2.14 32.07,35.97 32.07,36.2 | v18.26,64.93 16.83,66.36 16.35,66.36 v15.24,67.47
  Bottom 0.305: v32.07,36.04 34.27,33.83 U2.14 | v8.89,48.66 8.97,48.66 18.1,57.78
  Bottom 0.4: v71.44,65.41 69.61,67.23
  Bottom 0.406: v24.13,56.83 24.13,56.67 22.23,54.77 | 22.07,54.61 22.07,54.77 22.23,54.93 22.23,54.77 | 22.23,54.77 22.23,54.29 18.57,50.64 v18.57,46.67 | 25.24,36.99 25.08,37.15 v24.45,37.15 | v34.69,73.74 35.24,73.74 35.4,73.9 30.72,73.9 v30,74.61 30,73.66 30.48,73.18 | v41.27,67.71 41.27,64.85 42.15,63.98 42.15,61.04 v42.86,60.33 43.42,59.77 43.42,57.47 46.67,54.21 v46.67,53.98 | v27.62,74.61 27.62,73.1 27.54,73.03 | 26.75,73.74 27.11,74.1 | 26.19,73.74 25.96,73.74 | 18.26,57.78 18.1,57.78 18.41,57.47 19.05,57.47 | v29.53,62.23 26.11,62.23 21.35,57.47 v21.27,57.47 19.05,57.47 | 19.05,57.47 17.86,58.66 | v39.69,37.31 39.69,36.67 | v34.85,29.53 34.92,29.45 34.92,25.16 v33.58,23.81 | v27.94,29.69 26.83,28.57 25.72,28.57
  Bottom 0.508: U2.30 54.59,34.79 52.23,37.15 51.44,37.15 | MICROSD_CARD.6 19.07,64.11 v18.26,64.93 | v67.79,55.88 69.69,55.88 71.44,54.13 v71.44,53.02 | v71.91,47.47 71.75,47.31 69.22,47.31 69.06,47.15 | v34.69,73.74 34.77,73.66 34.69,73.58 | 34.69,73.58 34.45,73.34 | 34.69,73.58 34.69,71.04 37.62,68.1 v37.62,67.15 | v27.62,62.23 v29.53,62.23 | 37.7,53.82 37.78,53.9 v37.78,55.09 39.05,53.82 46.51,53.82 v46.67,53.98
  Bottom 0.61: v21.19,25.48 21.11,25.56 | v21.19,25.48 24.29,28.57 25.72,28.57 | v21.19,25.48 26.51,20.16 v28.57,20.16
  Bottom 0.8: v76.83,45.09 79.93,48.18 v79.93,48.34 | PILHA.3 21.31,74.18 21.75,73.74 26.19,73.74 26.75,73.74 v27.62,74.61 27.11,74.1 | v20.8,83.98 23.27,81.51 55.18,81.51 v55.56,81.12 25.88,81.12
  Bottom 0.813: 15.88,66.04 15.24,66.67 v15.24,67.47 15.24,72.87 18.2,75.83 PILHA.1
  Bottom 1.016: U2.20 41.89,34.47 39.69,36.67 39.69,36.99
  Bottom 1.27: U2.6 24.11,34.43 25.24,35.56 25.24,36.99
  other vias: 24.77,14.29 68.1,27.62 16.51,20 65.72,59.85 60.64,73.5 77.95,71.6 58.74,59.37 39.21,26.35 23.34,68.9 17.14,41.12 14.92,36.67 7.14,18.41 53.98,17.46 56.83,20.95 45.72,24.77 61.28,46.83 22.94,46.59 79.77,60.64
  pour Top (isolate 0.8): 64,0 83,0 arc90 86,3 86,13.5 arc90 84.5,15 arc-90 83,16.5 83,69.5 arc-90 84.5,71 arc90 86,72.5 86,83 arc90 83,86 62.5,86 arc90 61,84.5 arc-90 59.5,83 26.5,83 arc-90 25,84.5 arc90 23.5,86 3,86 arc90 0,83 0,72.5 arc90 1.5,71 arc-90 3,69.5 3,16.5 arc-90 1.5,15 arc90 0,13.5 0,3 arc90 3,0 22,0 arc90 25,3 arc-90 28,6 58,6 arc-90 61,3 arc90
  pour Bottom (isolate 0.8): 64,0 83,0 arc90 86,3 86,13.5 arc90 84.5,15 arc-90 83,16.5 83,69.5 arc-90 84.5,71 arc90 86,72.5 86,83 arc90 83,86 62.5,86 arc90 61,84.5 arc-90 59.5,83 26.5,83 arc-90 25,84.5 arc90 23.5,86 3,86 arc90 0,83 0,72.5 arc90 3.09,69.41 3.09,16.27 arc90 0,13.18 0,3 arc90 3,0 22,0 arc90 25,3 arc-90 28,6 58,6 arc-90 61,3 arc90
GPIO0  (via drill 0.35)
  Top 0.152: U1.B3 v33.97,47.62
  Bottom 0.152: ESP-01.6 65.88,19.53 42.86,19.53 35.56,26.83 35.56,31.91 34.92,32.54 33.02,32.54 31.79,33.77 U2.12 31.73,33.93 31.27,34.38 31.27,44.93 v33.97,47.62
GPIO2  (via drill 0.35)
  Top 0.152: U1.C4 35.24,48.9 32.38,48.9 v31.11,47.62
  Bottom 0.152: ESP-01.4 67.94,19.05 26.51,19.05 20.48,25.08 20.48,25.88 24.29,29.69 25.08,29.69 26.63,31.23 U2.7 27.94,32.52 27.94,39.05 26.19,40.8 26.19,42.7 v31.11,47.62
GPIO20P  (via drill 0.35)
  Top 0.152: U1.B4 33.97,50.16 32.7,50.16 27.15,44.61 v25.24,44.61 | v8.1,36.2 5.4,33.5 DEBUG1.1
  Bottom 0.152: v25.24,44.61 19.68,39.05 10.95,39.05 v8.1,36.2
GPIO23  (via drill 0.35)
  Top 0.152: U1.P5 50.48,50.16 v50.48,43.66 | CAN.2 9.71,64.42 10.79,63.34 v10.79,63.18 | v48.74,18.26 60.96,30.48 60.96,32.7 62.03,33.77 U2.36
  Bottom 0.152: v50.48,43.66 52.69,41.45 59.68,41.45 62.21,38.91 U2.36 | v10.79,63.18 7.3,59.69 7.3,35.72 24.77,18.26 v48.74,18.26
GPIO26  (via drill 0.35)
  Top 0.152: U1.R5 51.75,50.16 v51.75,43.66 | CAN.1 9.73,65.67 10.79,64.61 v10.79,64.29 | v50.48,17.46 63.5,30.48 63.5,32.7 64.57,33.77 U2.38
  Bottom 0.152: v51.75,43.66 53.5,41.91 60.17,41.91 64.75,37.33 U2.38 | v10.79,64.29 6.83,60.33 6.83,35.4 24.77,17.46 v50.48,17.46
GPIO27  (via drill 0.35)
  Top 0.152: U1.T5 59.21,43.97 v59.21,43.66
  Bottom 0.152: v59.21,43.66 67.31,35.56 67.31,35.24 67.31,34.92 67.31,33.79 U2.40
GPIO46  (via drill 0.35)
  Top 0.152: U1.T6 53.98,52.07 v62.39,43.66 | v70.48,39.85 70.48,39.8 DEBUG2.1
  Bottom 0.152: v70.48,39.85 66.2,39.85 v62.39,43.66
GPIO64  (via drill 0.35)
  Top 0.152: U1.R7 51.75,53.98 53.82,53.98 v54.61,54.77 | v64.61,54.77 66.83,52.55 66.83,51.59 78.11,40.32 78.26,40.16 79.69,38.73 DEBUG.2
  Bottom 0.152: v54.61,54.77 v64.61,54.77
GPIO65  (via drill 0.35)
  Top 0.152: U1.T7 54.29,53.34 v54.61,53.66 | v64.61,53.66 66.36,51.91 66.36,49.69 79.85,36.2 DEBUG.1
  Bottom 0.152: v64.61,53.66 v54.61,53.66
ID0  (via drill 0.35)
  Top 0.254: USB1.2 76.86,61.91 | v70.17,65.41
  Top 0.4: IC2.3 v70.17,65.41
  Top 0.734: U1.K14 v44.13,62.87
  Top 0.8: USB1.2 75.86,61.93 75.47,62.33 v70.17,62.33 v70.17,62.32
  Bottom 0.7: v44.13,62.87 44.55,63.28 46.03,64.76 | 46.03,64.76 46.08,64.81 46.08,65.79 46.08,65.88 46.03,65.83 46.03,64.76
  Bottom 0.8: 46.08,65.79 47.11,66.82 62.29,66.82 66.79,62.32 v70.17,62.32 v70.17,65.41
ID1  (via drill 0.35)
  Top 0.254: USB2.2 76.86,49.53 76.52,49.53
  Top 0.4: IC6.3 v70.17,53.02
  Top 0.734: U1.L14 v45.4,61.59
  Top 0.8: USB2.2 75.37,49.55 74.97,49.95 70.18,49.95 v70.17,49.94
  Bottom 0.61: v45.4,61.59 45.4,60.26 | 45.4,60.26 45.4,60.21 | 45.4,60.26 45.41,60.26 | 45.4,60.21 45.4,60.07 44.91,59.58 44.82,59.49 44.82,59.63 45.4,60.21
  Bottom 0.8: 44.91,59.58 44.91,58.05 53.02,49.94 v70.17,49.94 v70.17,53.02
MISO
  Top 0.406: IC3.15 37.15,22.86 40.94,26.65 40.94,27.74 U2.21
MOSI  (via drill 0.35)
  Top 0.406: IC3.14 37.15,21.59 41.91,26.35 v41.91,27.46
  Bottom 0.406: U2.19 41.89,27.48 v41.91,27.46
N$1
  Top 1.016: R1.1 LED1.A
N$2
  Top 1.016: U2.4 U2.2 19.03,35.73 5V.1
N$3
  Top 1.016: 3V3.2 17.14,36.39 17.14,33.12 U2.1 21.84,28.42 36.54,28.42 U2.17
N$5
  Top 1.016: R2.1 LED2.A
N$6
  Top 1.016: DEBUG1.2 R1.2
N$7
  Top 1.016: DEBUG2.2 R2.2
N$8
  Top 0.305: IC3.8 23.65,17.78 | 23.65,17.78 23.65,17.8 Y3.3 23.18,18.28 23.18,17.78 | C5.1 23.18,17.3 | 23.18,17.3 23.65,17.78 | 23.18,17.78 23.18,17.3 | 23.65,17.78 23.18,17.78
N$9
  Top 0.305: C4.1 20.32,16.52 20.32,19.66 Y3.1 21.21,20.89 21.91,21.59 23.34,21.59 25.88,19.05 IC3.7
N$51
  Top 0.406: U1.T11 54.93,60.96 54.93,62.2 S1.2
N$52
  Top 0.508: U1.N10 U1.N11
N$53
  Top 0.508: U1.N5 U1.N4
N$54
  Top 0.508: U1.L4 U1.M4
N$55
  Top 0.508: U1.D4 U1.E4
N$56
  Top 0.152: R29.2 37.47,69.22 42.86,69.22 U1.M16
N$57  (via drill 0.35)
  Top 0.254: v29.53,57.78 29.11,57.78 PWR.A
  Top 0.406: v40.32,57.78 U1.F11 | v40.32,57.78 U1.G11 | v40.32,57.78 40.32,58.42
  Top 0.508: U1.F11 40.32,58.42 U1.G11
  Bottom 0.254: v29.53,57.78 30.8,56.52 39.05,56.52 v40.32,57.78
N$58
  Top 0.813: PWR.C 28.16,54.93 R32.2
N$59
  Top 0.152: U1.H9 U1.J9
  Top 0.508: U1.F9 U1.F8 | U1.F9 U1.G9 | U1.G9 U1.H9 | U1.J9 U1.K9 | U1.K9 U1.L9 | U1.L9 U1.L8 | U1.L8 U1.K8 | U1.K8 U1.J8 | U1.J8 U1.H8 | U1.H8 U1.G8 | U1.G8 U1.F8 | U1.F9 U1.G8 | U1.G8 U1.H9 | U1.H9 U1.J8 | U1.J8 U1.K9 | U1.K9 U1.L8 | U1.L9 U1.K8 | U1.K8 U1.J9 | U1.J9 U1.H8 | U1.H8 U1.G9 | U1.G9 U1.F8 | U1.G9 U1.G8 | U1.H9 U1.H8 | U1.J9 U1.J8 | U1.K9 U1.K8 | U1.H7 U1.J7 | U1.J7 U1.J8 | U1.H7 U1.H8 | U1.H8 U1.J7 | U1.H7 U1.J8
N$60
  Top 0.152: U1.H10 U1.J10
  Top 0.406: U1.F10 39.85,56.99 40.8,56.99 U1.G10
  Top 0.508: U1.G10 U1.H10 | U1.J10 U1.K10 U1.L10 | U1.J11 U1.J10 | U1.H11 U1.H10 | U1.H11 U1.J11 | U1.H11 U1.J10 | U1.J11 U1.H10
N$61
  Top 0.254: U1.P11 50.48,57.78 53.02,57.78 58.1,62.87 58.1,66.67 58.74,67.31 U4.2
  Top 0.508: U1.N12 U1.P11
N$62
  Top 0.381: U1.R11 51.75,59.05 51.75,67.31 53.98,69.53 56.2,69.53 57,68.73 U4.4
N$63
  Top 0.254: 47.94,72.39 R33.2 | R33.2 47.48,72.56 Y1.1 44.13,73.98 39.69,73.98 C22.1 | U1.P16 49.85,71.44 48.58,72.7 R33.2
N$64
  Top 0.254: 47.94,71.12 R33.1 | R33.1 46.67,69.85 44.45,69.85 44.13,70.17 | 44.13,70.17 Y1.3 41.11,70.95 C24.1 | 44.13,70.17 | U1.N16 48.58,69.85 R33.1
N$65
  Top 0.254: C22.2 38.74,70.81 40.64,72.7 C24.2 43.2,72.7 Y1.2 43.65,72.56 45.25,70.95 Y1.4 45.62,70.95 46.42,71.75 48.58,71.75 49.21,71.12 49.21,64.14 U1.N15
N$66
  Top 0.254: U1.A5 31.11,50.8 R34.1 28.48,50.48 Y2.P$4 24.5,49.84 23.24,48.58 20,48.58 C26.1
N$67
  Top 0.254: U1.A6 31.11,52.07 R34.2 28.48,52.38 Y2.P$1 24.5,53.03 23.24,54.29 21.43,54.29 20.48,53.34 16.51,53.34 C25.1
N$68
  Top 0.254: C25.2 15.88,50.48 17.78,52.38 C26.2 18.26,52.38 19.21,51.44 33.97,51.44 U1.B5
N$69
  Top 0.508: U1.D6 U1.D7
N$70
  Top 0.254: U1.A9 31.75,55.88 C27.2
  Top 0.508: U1.B9 U1.A9
N$71
  Top 0.254: U1.A7 32.39,53.34 C27.1
  Top 0.508: U1.B7 U1.A7
N$72
  Top 0.152: U1.M3 46.67,47.62 46.67,45.24 49.1,42.81 57.2,42.81 60.96,39.05 R35.2 61.28,38.87
N$73
  Top 0.152: R36.2 55.88,39.05 53.37,41.56 47.98,41.56 45.56,43.98 45.56,46.51 U1.L2
N$74
  Top 0.152: U1.L3 45.25,47.48 45.25,43.33 47.54,41.04 51.35,41.04 53.34,39.05 R37.2
N$75
  Top 0.152: R38.2 50.8,39.05 49.22,40.63 47,40.63 44.77,42.86 U1.K1
N$76
  Top 0.152: U1.K2 44.29,46.51 44.29,42.38 | R39.2 47.3,40.32 46.19,40.32 44.29,42.23 44.29,42.38 | 44.29,42.38
N$77
  Top 0.152: R40.2 43.98,41.1 43.98,47.48 U1.K3
N$78
  Top 0.152: R41.2 U1.J1
N$79
  Top 0.152: U1.J2 43.02,46.51 43.02,41.11 R42.2
N$80
  Top 0.152: U1.J3 42.71,47.47 42.71,42.23 40.48,40 39.37,40 R43.2
N$81
  Top 0.152: R44.2 36.04,39.05 37.31,40.32 39.69,40.32 42.23,42.86 U1.H1
N$82
  Top 0.152: U1.G1 40.96,44.45 38.18,41.67 31.04,41.67 28.42,39.05 R45.2
N$83
  Top 0.152: U1.G2 40.48,46.51 40.48,44.92 37.63,42.08 28.9,42.08 25.88,39.05 R46.2
N$84
  Top 0.152: U1.G3 40.17,47.47 40.17,45.52 37.2,42.55 28.74,42.55 26.67,40.48 24.77,40.48 23.34,39.05 R47.2
N$85
  Top 0.152: U1.H3 41.44,47.47 41.44,43.98 38.74,41.28 33.03,41.28 R48.1
N$86
  Top 0.152: U1.H2 41.75,46.51 41.75,43.34 39.21,40.8 35.24,40.8 33.5,39.05 R49.1
N$87
  Top 0.152: R50.1 58.42,39.05 55.4,42.07 48.42,42.07 46.04,44.45 U1.L1
PWM  (via drill 0.35)
  Top 0.406: v37.78,44.29 34.77,44.29 U1.A1
  Bottom 0.152: U2.32 46.66,44.25 46.71,44.29 69.85,44.29 76.99,51.44 76.99,66.67 70.17,73.5 64.28,73.5 PILHA.35
  Bottom 0.406: U2.32 46.62,44.29 v37.78,44.29
PWM1  (via drill 0.35)
  Top 0.152: U1.P12 v50.48,59.05 | v64.61,57.94 74.45,57.94 78.58,53.82 78.58,47.78 78.11,47.31 78.11,43.18 78.74,42.55 78.9,42.39 DEBUG.3
  Bottom 0.152: v50.48,59.05 51.59,57.94 v64.61,57.94
RESET  (via drill 0.35)
  Top 0.152: U1.C3 v35.24,47.62
  Bottom 0.152: ESP-01.5 64.61,26.19 41.43,26.19 38.1,29.53 38.1,32.48 U2.16 32.38,38.2 32.38,45.09 34.92,47.62 v35.24,47.62
RX1  (via drill 0.35)
  Top 0.152: 51.8,78.37 PILHA.28 51.75,78.37 | U1.P15 50.48,64.14 50.48,77.15 51.7,78.37 51.75,78.37 | v24.61,41.27 23.34,42.55 18.3,42.55 10.95,49.89 10.95,57.78 12.06,58.9 12.06,65.41 v12.22,65.56 | v10.48,67.23 8.89,68.82 8.89,76.68 12.38,80.17 50.01,80.17 51.75,78.42 51.75,78.37
  Bottom 0.152: v24.61,41.27 26.67,39.21 26.67,33.79 U2.8 | v12.22,65.56 12.14,65.56 v10.48,67.23
RXCAN1
  Top 0.152: IC3.2 24.77,25.4 23.48,26.68 IC9.4
SCL1  (via drill 0.35)
  Top 0.152: U1.B11 v35.24,57.78
  Bottom 0.152: v35.24,57.78 39.53,62.07 39.53,73.73 PILHA.19
SCL2  (via drill 0.35)
  Top 0.152: U1.D10 v37.78,57.78
  Top 0.508: U1.C10 U1.D10
  Bottom 0.152: PILHA.24 45.4,77.06 45.4,75.09 40.01,69.69 40.01,61.12 37.78,58.9 v37.78,57.78
SCL3
  Bottom 0.152: U2.5 22.57,29.69 21.11,29.69 20.32,30.48 20.32,38.68 30.38,48.74 71.75,48.74 76.04,53.02 76.04,66.04 70.17,71.91 51.12,71.91 47.94,75.09 47.94,77.06 PILHA.26
SCLK
  Top 0.406: IC3.13 37.15,20.32 46.97,30.14 U2.23
SDA1  (via drill 0.35)
  Top 0.152: U1.A11 v33.97,57.78
  Bottom 0.152: v33.97,57.78 34.29,57.78 39.09,62.59 PILHA.17
SDA2  (via drill 0.35)
  Top 0.152: v39.05,59.05 37.78,59.05 U1.D11
  Top 0.508: U1.C11 U1.D11
  Bottom 0.152: v39.05,59.05 40.48,60.48 40.48,69.6 PILHA.23
SDA3
  Bottom 0.152: PILHA.25 52.37,72.71 70.17,72.71 76.52,66.36 76.52,52.23 72.55,48.26 30.64,48.26 22.86,40.48 22.86,32.52 U2.3
SDMMC_CK  (via drill 0.35)
  Top 0.152: U1.B15 33.97,64.14 v33.97,66.04
  Bottom 0.152: 19.94,63.02 MICROSD_CARD.5 20.58,63.01 23.76,66.19 33.83,66.19 v33.97,66.04
SDMMC_CMD  (via drill 0.35)
  Top 0.152: v17.14,64.93 16.99,65.09 16.99,69.69 R10.1 | v35.08,65.56 34.61,65.09 U1.B16
  Bottom 0.152: v17.14,64.93 18.84,63.24 18.84,61.45 19.47,60.81 MICROSD_CARD.3 20.58,60.81 24.55,64.78 34.51,64.78 35.08,65.36 v35.08,65.56
SDMMC_D0  (via drill 0.35)
  Top 0.152: v18.26,66.04 17.46,66.83 17.46,67.63 R11.1 | U1.A16 33.34,66.67 v33.18,66.83
  Bottom 0.152: v18.26,66.04 19.08,65.21 MICROSD_CARD.7 20.45,65.21 22.07,66.83 v33.18,66.83
SDMMC_D1  (via drill 0.35)
  Top 0.152: v18.26,67.15 18.26,67.79 20,69.53 21.91,69.53 R12.1 | U1.A15 32.38,64.45 32.38,67.47 v32.7,67.79
  Bottom 0.152: v18.26,67.15 19.09,66.31 MICROSD_CARD.8 20.59,66.31 22.07,67.79 v32.7,67.79
SDMMC_D2  (via drill 0.35)
  Top 0.152: v17.14,62.71 16.03,63.82 16.03,67.79 R8.1 | U1.C16 v35.24,64.14
  Bottom 0.152: v17.14,62.71 17.94,61.91 17.94,60.17 19.47,58.63 19.93,58.63 MICROSD_CARD.1 20.58,58.61 25.82,63.85 34.96,63.85 v35.24,64.14
SDMMC_D3  (via drill 0.35)
  Top 0.152: v17.14,63.82 16.51,64.45 16.51,69.85 R9.1 | U1.C15 v36.51,64.14
  Bottom 0.152: v17.14,63.82 18.36,62.6 18.36,60.82 19.47,59.71 MICROSD_CARD.2 20.58,59.71 22.78,61.91 25.19,64.32 34.55,64.32 35.08,64.85 35.8,64.85 v36.51,64.14
SYS_VOUT
  Top 0.254: U1.L7 46.67,52.7 | C20.1 56.51,52.7 46.83,52.7 46.67,52.7 | U1.L6 46.67,52.7 | 46.67,52.7 46.04,52.7
  Top 0.508: U1.K7 U1.L7 | U1.L7 46.04,52.7 U1.L6 | U1.L6 U1.K6 | U1.K6 U1.K7 | U1.K7 U1.L6 | U1.L7 U1.K6
TX1  (via drill 0.35)
  Top 0.152: U1.R16 51.12,75.09 51.79,75.76 PILHA.27 51.86,75.83 53.02,76.99 53.02,79.22 51.59,80.64 12.22,80.64 8.45,76.87 8.45,67.67 v8.89,67.23 | v26.99,41.91 25.88,43.02 18.41,43.02 11.43,50.01 11.43,57.63 12.54,58.74 12.54,61.59 12.86,61.91 v12.86,63.18
  Bottom 0.152: v26.99,41.91 29.21,39.69 29.21,33.79 U2.10 | v12.86,63.18 8.89,67.15 v8.89,67.23
TXCAN1
  Top 0.152: 23.34,22.87 IC9.1 25.09,22.87 25.72,23.5 28.1,23.5 28.42,23.81 28.42,25.72 27.46,26.67 IC3.1 26.57,26.67
UART0_RX  (via drill 0.35)
  Top 0.152: 33.54,59.9 U1.A12 v33.97,60.33 | ESP-01.1 73.5,22.38 73.5,20.32 65.41,12.22 16.83,12.22 8.89,20.16 8.89,39.37 v9.68,40.16
  Bottom 0.152: v9.68,40.16 9.68,46.83 19.05,56.2 22.38,56.2 26.51,60.33 v33.97,60.33
UART0_TX  (via drill 0.35)
  Top 0.152: U1.B12 35.24,60.33 v35.24,61.59 | ESP-01.8 56.52,12.7 16.99,12.7 9.68,20 v9.68,39.05
  Bottom 0.152: v9.68,39.05 8.89,39.85 8.89,46.67 18.89,56.67 22.23,56.67 26.35,60.8 33.34,60.8 34.13,61.59 v35.24,61.59
VBUS1  (via drill 0.35)
  Top 0.152: C7.1
  Top 0.4: IC6.5 72.72,54.61 73.34,53.99 v73.34,53.66
  Top 0.734: U1.M15 v47.94,64.14
  Top 0.8: v75.25,53.34 75.29,53.3 USB2.5 73.34,56.83 C7.1 | v64.61,56.83 C7.1
  Bottom 0.8: v64.61,56.83 51.12,56.83 49.37,58.58 49.37,59.37 50.01,60.01 53.02,60.01 54.29,61.28 54.29,62.07 52.23,64.14 v47.94,64.14 | v75.25,53.34 73.66,53.34 v73.34,53.66
VDD_RTC  (via drill 0.35)
  Top 0.305: U1.L11 46.67,59.05 47.62,59.05 47.62,59.06 47.94,59.38 v47.94,60.33 | v53.18,61.59 53.18,64.61 C21.1
  Top 0.381: U4.5 55.23,66.66 C21.1
  Top 0.508: U1.K11 U1.L11
  Bottom 0.305: v47.94,60.33 48.58,60.96 52.55,60.96 v53.18,61.59
VIN_BAT
  Top 0.508: U1.T8 U1.R8 U1.P8 U1.N7
VIN_USB  (via drill 0.35)
  Top 0.254: C2.1
  Top 0.381: U1.T9
  Top 0.4: IC2.5 72.72,66.99 73.34,66.37 v73.34,66.04
  Top 0.734: U1.J16 42.39,65.88 v42.39,66.2
  Top 0.8: v75.25,65.72 75.29,65.68 USB1.5 73.98,68.58 66.68,68.58 C2.1 | U1.P9 U1.R9 U1.T9 v54.61,55.88
  Bottom 0.152: 45.8,70.41 45.88,70.48
  Bottom 0.8: v54.61,55.88 65.45,55.88 71.1,61.53 71.1,61.57 v75.25,65.72 73.66,65.72 v73.34,66.04 68.9,70.48 45.88,70.48 | 45.8,70.41 45.48,70.41 42.39,67.31 v42.39,66.2

## Text on the board
tNames: Comim OBC - v.3.0 2021